# EAGLE design dc-power-board (EAGLE 5.07)
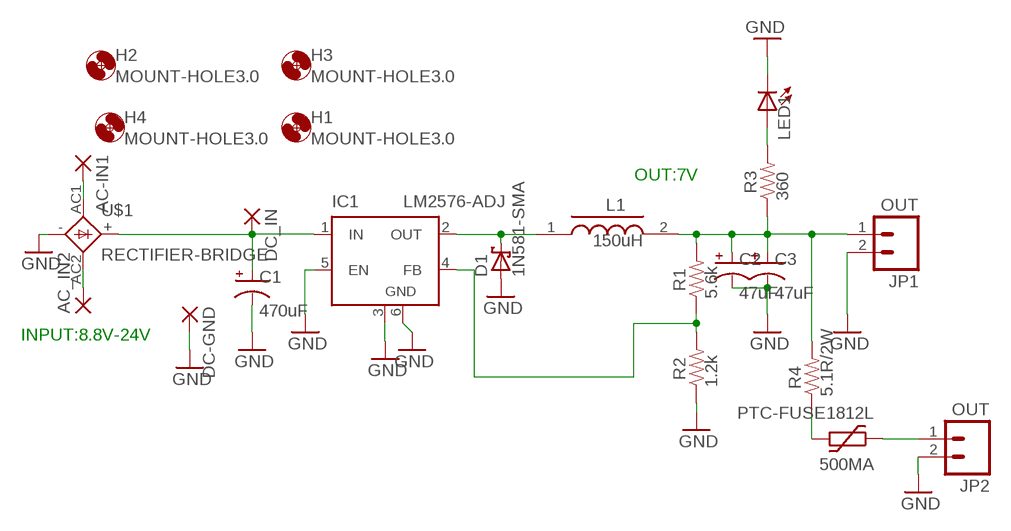
[diagram p0: schematic, sheet 1]

## Parts
500MA  PTC-FUSE1812L  [1812L]
AC-IN1  WIREPADSMD5-2,5  [5-2,5]
AC_IN2  WIREPADSMD5-2,5  [5-2,5]
C1  470uF  CAP_POLPTH3  [CPOL-RADIAL-1000UF-63V]
C2  47uF  CAP_POL-CT6032  [CT6032]
C3  47uF  CAP_POL-CT6032  [CT6032]
D1  1N581-SMA  [SMA-DIODE]
DC-GND  WIREPADSMD5-2,5  [5-2,5]
DC_IN  WIREPADSMD5-2,5  [5-2,5]
H1  MOUNT-HOLE3.0  [3,0]
H2  MOUNT-HOLE3.0  [3,0]
H3  MOUNT-HOLE3.0  [3,0]
H4  MOUNT-HOLE3.0  [3,0]
IC1  LM2576-ADJ  LM2596S  [TO263-5]
JP1  OUT  CON-02XH-V  [XH-1X2-LONG-LOCK-V]
JP2  OUT  CON-02XH-V  [XH-1X2-LONG-LOCK-V]
L1  150uH  INDUCTOR-I-CDRH125  [CDRH125]
LED1  LED3MM  [LED3MM]
R1  5.6k  RESISTOR0207/7(1/4W)  [0207/7]
R2  1.2k  RESISTOR0207/7(1/4W)  [0207/7]
R3  360  RESISTOR0207/7(1/4W)  [0207/7]
R4  5.1R/2W  RESISTOR0617/22(3W)  [0617/22]
U$1  RECTIFIER-BRIDGE  [KBP310]

## Nets
GND: C1.2(-) C2.- C3.- D1.A DC-GND.1(P) IC1.3(GND) IC1.5(EN) IC1.6(GND) JP1.2 JP2.2 LED1.K(C) R2.1 U$1.-
N$1: C1.1(+) DC_IN.1(P) IC1.1(IN) U$1.+
N$2: 500MA.P$1 JP2.1
N$3: LED1.A R3.2
N$4: AC-IN1.1(P) U$1.AC1
N$5: D1.C IC1.2(OUT) L1.1
N$6: AC_IN2.1(P) U$1.AC2
N$7: C2.+ C3.+ JP1.1 L1.2 R1.2 R3.1 R4.2
N$8: 500MA.P$2 R4.1
N$11: IC1.4(FB) R1.1 R2.2

## Notes on the sheet
- OUT:7V
- INPUT:8.8V-24V

## Library data of the parts
500MA = digital-toy:PTC-FUSE
AC-IN1 AC_IN2 DC-GND DC_IN = wirepad:WIREPAD: Wire PAD connect wire on PCB
C1-C3 = digital-toy:CAP_POL: Capacitor Polarized These are standard SMD and PTH capacitors. Normally 10uF, 47uF, and 100uF in electrolytic and tantalum varieties. Always verify the external diameter of the through hole cap, it varies with capacity, voltage, and manufacturer. The EIA devices should be standard. PANASONIC_D size: 6.5mmx6.5mmx5.5mm, 100uf (taobao:6.3mmx5.5mm), same as CVL0605 153cvl0405 size: 4mmx4mmx5.5mm, 10uf (taobao:4mmx5.5mm) ct6032 typical 47uF Tantalum, comment by hyl.
D1 = digital-toy:1N581*: 1.0A SCHOTTKY BARRIER RECTIFIER Source: http://www.diodes.com/datasheets/ds23001.pdf
H1-H4 = holes:MOUNT-HOLE: MOUNTING HOLE with drill center marker
IC1 = linear:LM2596S: STEP-DOWN VOLTAGE REGULATOR
JP1 JP2 = digital-toy:CON-02: Header 2 Standard 2-pin 0.1" header. Use with straight break away headers (SKU : PRT-00116), right angle break away headers (PRT-00553), swiss pins (PRT-00743), machine pins (PRT-00117), and female headers (PRT-00115). Molex polarized connector foot print use with SKU : PRT-08233 with associated crimp pins and housings.
L1 = digital-toy:INDUCTOR-I: Inductors with Iron
LED1 = digital-toy:LED: LEDs Standard schematic elements and footprints for 5mm, 3mm, 1206, and 0603 sized LEDs. 5mm - Spark Fun Electronics SKU : COM-00529 (and others) copy led.lbr 0805 led here, by hyl digital-toy. 2010.6.29
R1-R4 = digital-toy:RESISTOR: Resistor Basic schematic elements and footprints for 0603, 1206, and PTH 1/10th watt (small) resistors. digital-toy copy vertical mount of axial-0.3 from rcl.lbr : the 0207/xx 3W resistor: 0617/17, 0617/22, 0617V
U$1 = digital-toy:RECTIFIER-BRIDGE: refctifier bridge kbp310:14.4mmx11.1mm by hyl dtoy 2011/4/16

## Board
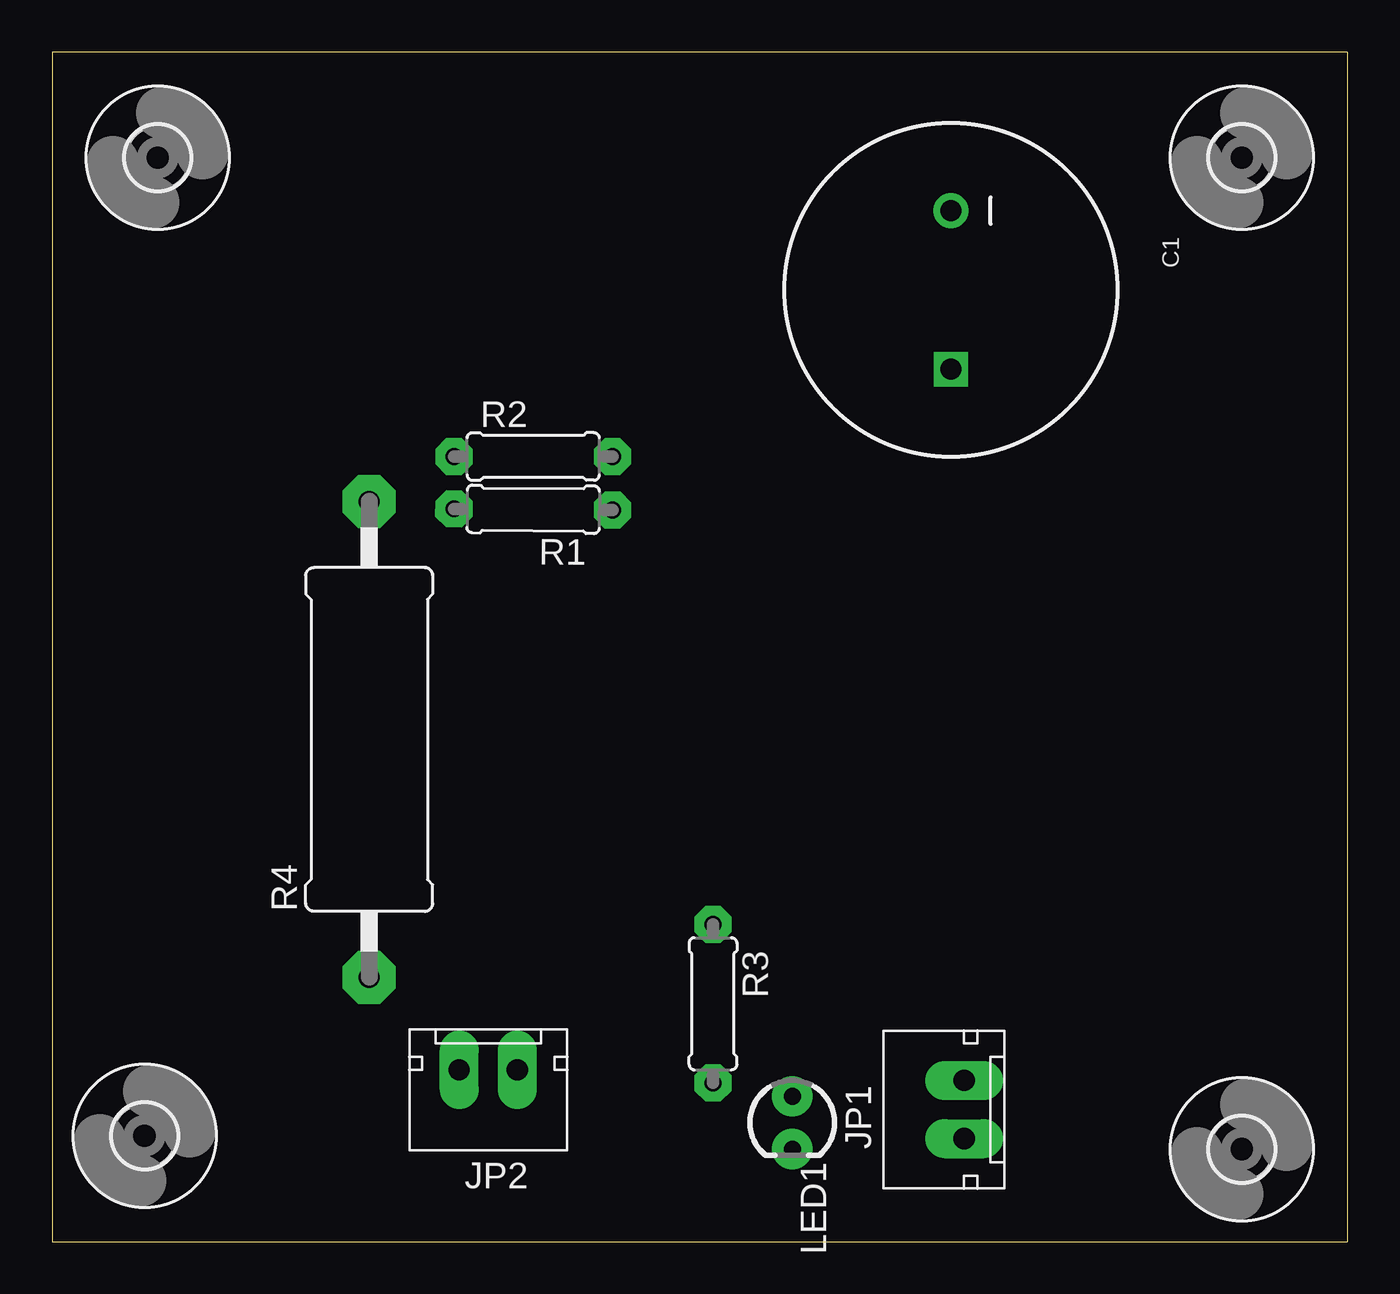
[diagram p1: board, top side]
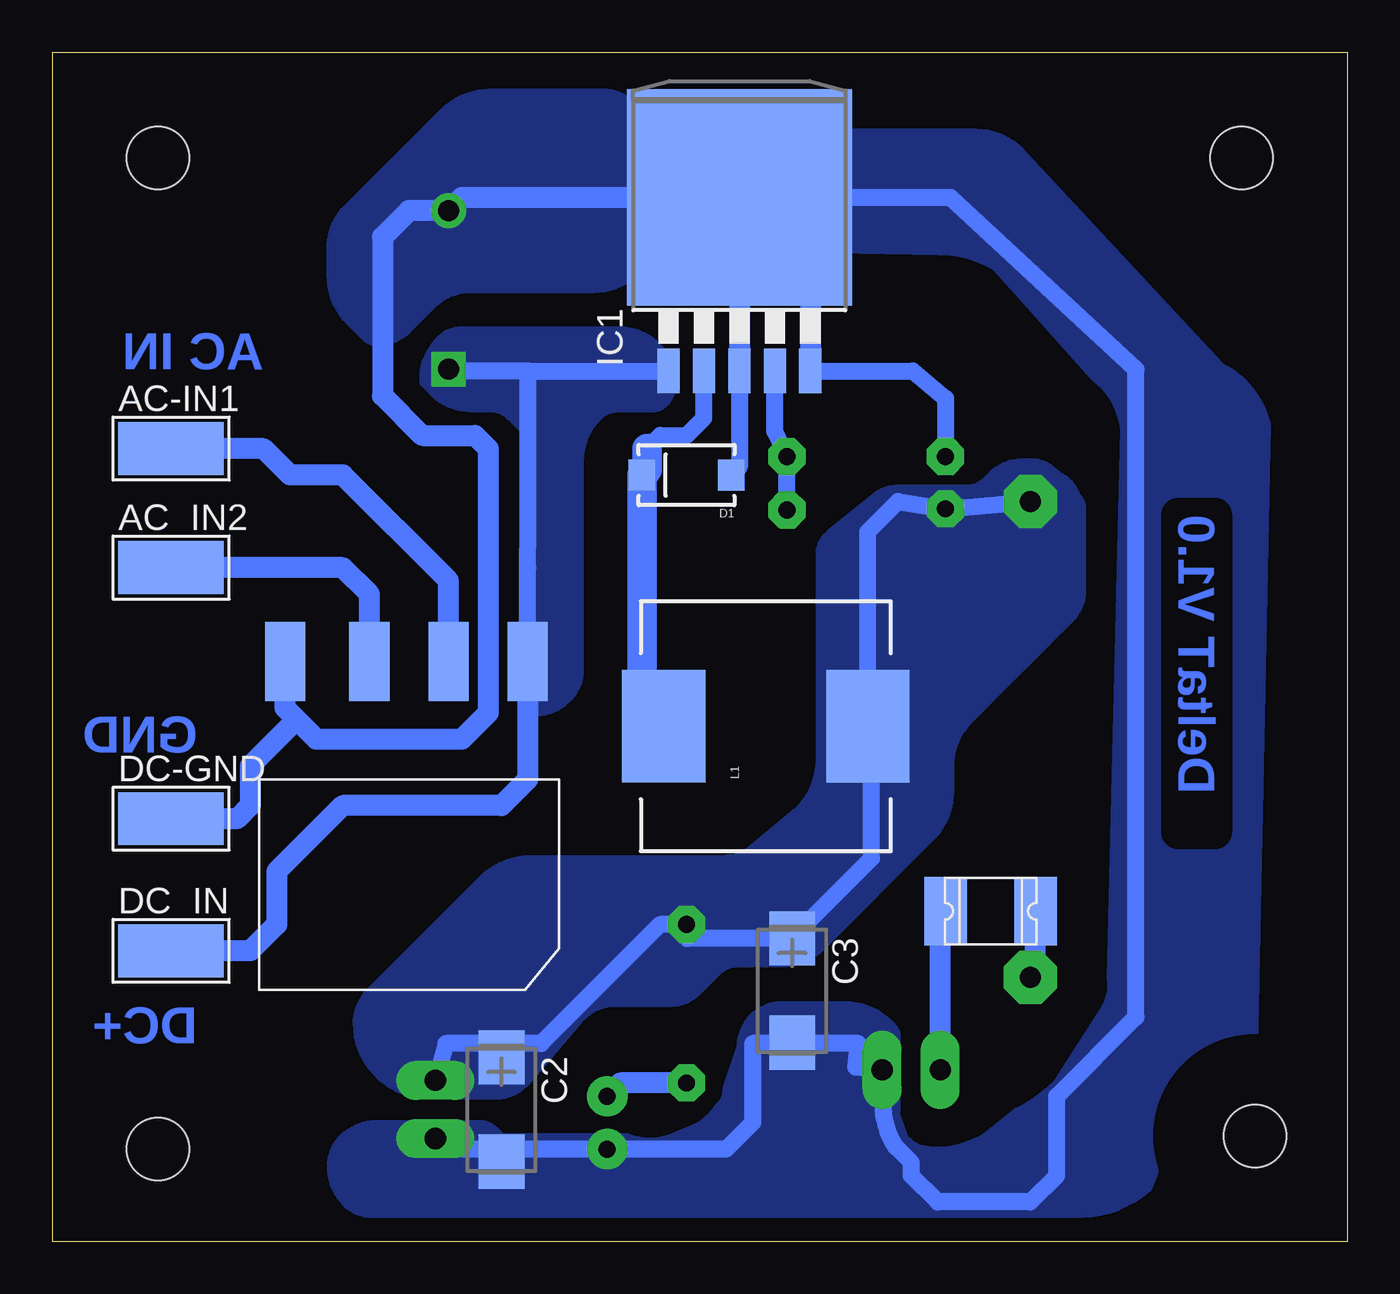
[diagram p2: board, bottom side, seen from below]

Size 62.23 x 57.15 mm. Coordinates in mm from the lower left corner, seen from the top.
Outline: 0,0 62.23,0 62.23,57.15 0,57.15 0,0
Copper layers (1*16): Top 0.035mm / dielectric 1.5mm / Bottom 0.035mm
Design rules "SparkFun": minimum track width 8mil, minimum drill 20mil, track to track 8mil, track to pad 8mil, pad to pad 8mil, via to via 8mil, smd to smd 8mil, copper to edge 10mil, drill to drill 8mil, minimum pad ring 12mil, minimum via ring 10mil, stop-mask expansion 4mil, vias tented up to drill 25mil, thermal gap 10mil

### Footprints (pad centres in the part's own frame; a part is rotated, then mirrored left to right if it is on the bottom)
1812L = smd 2.03 x 3.3: P$1 -2.16,0; P$2 2.16,0
5-2,5 = smd 2.54 x 5.08: 1 0,0
CPOL-RADIAL-1000UF-63V = drill 1.016 pad 1.651 square: 1 3.81,0 | drill 1.016 pad 1.676 round: 2 -3.81,0
CT6032 = smd 2.6 x 2.2: + -2.5,0; - 2.5,0
SMA-DIODE = smd 1.27 x 1.47: A -2.15,0; C 2.15,0
3,0 = hole 3: 0,0
TO263-5 = smd 1.067 x 2.159: 1 -3.404,-5.791; 2 -1.702,-5.791; 3 0,-5.791; 4 1.702,-5.791; 5 3.404,-5.791 | smd 10.8 x 10.41: 6 0,2.54
XH-1X2-LONG-LOCK-V = drill 1.016 pad 1.88 long: 1 -1.397,0; 2 1.397,0
CDRH125 = smd 5.4 x 4: 1 0,4.9; 2 0,-4.9
LED3MM = drill 0.813 pad 1.93 round: A -1.27,0; K 1.27,0
0207/7 = drill 0.813 pad 1.778 octagon: 1 -3.81,0; 2 3.81,0
0617/22 = drill 1.016 pad 2.54 octagon: 1 -11.43,0; 2 11.43,0
KBP310 = smd 1.93 x 3.81: + -5.7,-10.724; - 5.954,-10.724; AC1 -1.9,-10.724; AC2 1.9,-10.724

### Placement (x,y rotation side)
500MA  17.14,15.88 0 bottom
AC-IN1  56.52,38.1 270 bottom
AC_IN2  56.52,32.38 270 bottom
C1  43.18,45.72 270 top
C2  40.64,6.35 270 bottom
C3  26.67,12.06 270 bottom
D1  31.75,36.83 180 bottom
DC-GND  56.52,20.32 270 bottom
DC_IN  56.52,13.97 270 bottom
H1  4.45,5.08 0 top
H2  57.15,52.07 0 top
H3  57.15,4.45 0 top
H4  5.08,52.07 0 top
IC1  29.21,47.62 0 bottom
JP1  43.81,6.35 270 top
JP2  20.95,8.26 0 top
L1  27.94,24.77 90 bottom
LED1  35.56,5.71 270 top
R1  23.11,35.18 179.6 top
R2  23.11,37.72 0 top
R3  31.75,11.43 270 top
R4  15.24,24.13 90 top
U$1  45.09,17.14 180 bottom

### Tracks (layer width: path | path; a pad name or v marks a point on that pad's centre or on a via)
GND
  Bottom 0.813: IC1.5 20.88,41.83 19.3,40.51 R2.1 | IC1.3 29.21,37.22 D1.A | JP1.2 44.58,4.45 LED1.K 29.84,4.45 28.57,5.71 28.57,9.53 23.5,9.53 23.62,8.38 JP2.2 22.25,7.09 arc-43 21.7,4.55 20.95,3.81 20.95,3.17 19.68,1.91 15.24,1.91 13.97,3.17 13.97,6.99 10.16,10.79 10.16,41.91 19.05,50.16 IC1.6 29.21,48.26 25.81,48.26
  Bottom 1.016: IC1.6 42.55,50.16 C1.2 45.09,49.53 46.35,48.26 46.35,40.64 44.45,38.73 41.91,38.73 41.27,38.1 41.27,25.4 42.55,24.13 49.53,24.13 50.48,25.08 | 29.21,48.26 IC1.3 | 25.81,48.26 IC1.5 | U$1.- 51.04,25.64 50.48,25.08 | DC-GND.1 53.34,20.32 52.7,20.95 52.7,22.86 50.48,25.08
  pour Bottom (isolate 0.813, no thermals): 4.45,7.84 arc45 9.12,3.58 9.55,2.52 arc45 13.19,1.27 46.89,1.27 arc45 48.15,1.79 arc45 48.9,3.6 arc45 48.3,5.04 arc45 46.68,5.71 41.54,5.71 arc45 40.64,5.08 34.6,5.08 arc-45 32.35,5.12 31.27,5.56 arc-45 29.84,7.47 29.21,9.38 arc90 27.16,11.43 24.18,11.43 arc45 21.93,10.5 21.85,10.42 arc45 21.59,9.79 21.59,6.3 arc-45 21.56,5.93 21.48,5.61 arc-45 21.48,5.71 21.27,5.08 arc-45 20.28,4.48 arc-45 17.14,5.29 15.89,6.31 arc-20 13.99,7.67 11.85,11.01 arc-45 11.43,12.65 10.79,39.03 arc-47 12.24,41.51 16.91,46.75 arc-35 19.64,47.5 26.04,47.62 26.67,48.26 26.67,51.24 arc45 26.08,52.66 25.29,52.81 arc45 24.02,53.34 17.88,53.34 arc40 15.8,52.57 6.05,42.1 arc50 3.81,39.25
  pour Bottom (isolate 1.016, no thermals): 41.13,55.24 arc-45 43.55,54.24 48.06,49.73 arc-45 48.9,47.72 48.9,46.4 arc-45 47.97,44.16 47.25,43.44 arc-45 46.62,43.18 46.55,43.18 arc-45 45.13,43.77 43.95,44.95 arc45 42.1,45.72 36.24,45.72 arc-45 34,46.65 33.02,47.62 33.02,53.34 34.34,54.66 arc-45 35.76,55.24
N$1
  Bottom 0.813: 39.37,41.83 IC1.1 | 39.37,41.83 43.1,41.83 C1.1 | U$1.+ 39.38,32.37 39.37,34.29 39.37,41.83
  Bottom 1.016: U$1.+ 39.37,27.85 39.37,22.23 40.64,20.95 48.26,20.95 51.44,17.78 51.44,15.24 52.7,13.97 DC_IN.1
  pour Bottom (no thermals): 43.62,43.38 arc-45 44.45,41.37 arc-45 44.38,41.21 43.92,40.75 arc-45 42.13,40.01 41.23,40.01 arc45 40.22,39.59 39.37,38.73 39.37,25.84 arc-90 38.93,25.4 arc-45 37.51,25.99 37.36,26.14 arc-45 36.83,27.41 36.83,37.53 arc45 35.98,39.59 arc45 34.97,40.01 33.33,40.01 arc-45 32.8,40.22 arc-45 32.38,41.23 arc-90 34.97,43.81 42.56,43.81 arc-45
N$2
  Bottom 1.016: 500MA.P$1 19.56,15.88 JP2.1
N$3
  Bottom 1.016: R3.2 34.92,7.62 LED1.A
N$4
  Bottom 1.016: U$1.AC1 43.19,31.75 48.26,36.83 50.8,36.83 52.07,38.1 AC-IN1.1
N$5
  Bottom 0.813: IC1.2 30.91,39.57 31.75,38.73 33.02,38.73 33.66,38.1 | L1.1 33.9,24.77
  Bottom 1.422: 33.66,38.1 33.66,37.08 D1.C 33.9,24.77
N$6
  Bottom 1.016: U$1.AC2 46.98,31.11 48.26,32.38 AC_IN2.1
N$7
  Bottom 0.813: JP1.1 43.31,9.53 38.73,9.53 33.02,15.24 R3.1 31.71,14.56 C3.+ 26.71,14.56 22.86,18.41 22.86,24.59 L1.2 23.04,34.11 21.59,35.56 R1.2 R4.2
  pour Bottom (no thermals): 12.7,35.19 arc-45 12.96,35.82 arc-45 13.86,36.83 14.21,37.13 arc-40 15.13,37.47 15.68,37.47 arc-45 17.1,36.88 17.36,36.61 arc45 18.37,36.2 21.73,36.2 arc-39 22.61,35.88 24.87,34.08 arc-51 25.4,32.97 25.4,23.11 arc50 26.57,20.62 28.57,18.95 arc40 30.04,18.41 39.22,18.41 arc-45 41.64,17.41 46.95,12.1 arc-45 47.62,10.48 arc-90 44.13,6.99 40.83,6.99 arc-49 39.47,7.61 36.88,10.63 arc49 35.14,11.43 32.49,11.43 arc-45 31.22,11.96 30.26,12.92 arc45 29.26,13.34 27.21,13.34 arc-45 25.2,14.17 19.98,19.39 arc-45 19.05,21.64 19.05,22.81 arc45 18.12,25.06 13.29,29.89 arc-45 12.7,31.31
N$8
  Bottom 1.016: R4.1 14.98,12.7 500MA.P$2
N$11
  Bottom 0.813: IC1.4 27.51,38.94 R2.2 R1.1

### Text on the board
Bottom: AC IN | DeltaT V1.0 | GND | DC+